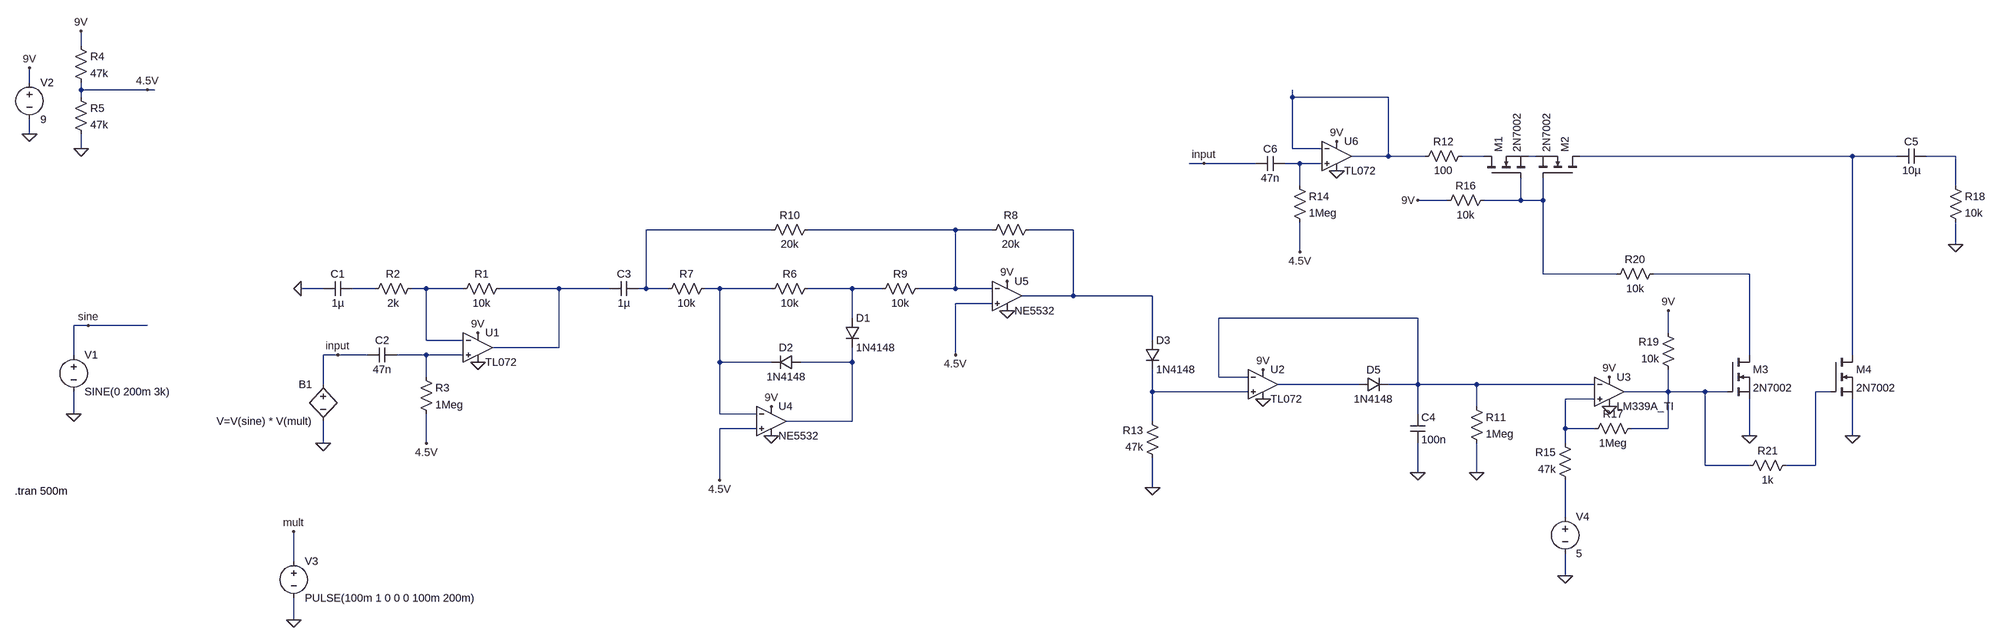
[diagram p0: schematic threshold.asc]
threshold.asc, the LTspice schematic file:
Version 4
SHEET 1 4932 804
WIRE -656 -464 -656 -496
WIRE -768 -384 -768 -416
WIRE -656 -368 -656 -384
WIRE -512 -368 -656 -368
WIRE -496 -368 -512 -368
WIRE -656 -352 -656 -368
WIRE 2256 -352 2256 -368
WIRE 2464 -352 2256 -352
WIRE -768 -272 -768 -304
WIRE -656 -240 -656 -272
WIRE 2256 -240 2256 -352
WIRE 2320 -240 2256 -240
WIRE 2464 -224 2464 -352
WIRE 2464 -224 2384 -224
WIRE 2544 -224 2464 -224
WIRE 2672 -224 2624 -224
WIRE 2784 -224 2768 -224
WIRE 3472 -224 2880 -224
WIRE 3568 -224 3472 -224
WIRE 3696 -224 3632 -224
WIRE 2064 -208 2032 -208
WIRE 2176 -208 2064 -208
WIRE 2272 -208 2240 -208
WIRE 2320 -208 2272 -208
WIRE 2272 -160 2272 -208
WIRE 3696 -160 3696 -224
WIRE 2592 -128 2528 -128
WIRE 2752 -128 2752 -176
WIRE 2752 -128 2672 -128
WIRE 2800 -128 2800 -176
WIRE 2800 -128 2752 -128
WIRE 976 -64 704 -64
WIRE 1376 -64 1056 -64
WIRE 1456 -64 1376 -64
WIRE 1632 -64 1536 -64
WIRE 3696 -32 3696 -80
WIRE 2272 -16 2272 -80
WIRE 2800 32 2800 -128
WIRE 2960 32 2800 32
WIRE 3248 32 3040 32
WIRE -112 64 -160 64
WIRE 0 64 -48 64
WIRE 112 64 80 64
WIRE 192 64 112 64
WIRE 400 64 272 64
WIRE 624 64 400 64
WIRE 704 64 704 -64
WIRE 704 64 688 64
WIRE 752 64 704 64
WIRE 864 64 832 64
WIRE 976 64 864 64
WIRE 1152 64 1056 64
WIRE 1216 64 1152 64
WIRE 1376 64 1376 -64
WIRE 1376 64 1296 64
WIRE 1456 64 1376 64
WIRE 1632 80 1632 -64
WIRE 1632 80 1520 80
WIRE 1952 80 1632 80
WIRE 1456 96 1376 96
WIRE 1152 128 1152 64
WIRE 2528 128 2096 128
WIRE -640 144 -672 144
WIRE -512 144 -640 144
WIRE 3072 160 3072 112
WIRE 112 176 112 64
WIRE 192 176 112 176
WIRE 1952 176 1952 80
WIRE 400 192 400 64
WIRE 400 192 256 192
WIRE -672 208 -672 144
WIRE -80 208 -112 208
WIRE -16 208 -80 208
WIRE 112 208 48 208
WIRE 192 208 112 208
WIRE 1376 208 1376 96
WIRE 3248 208 3248 32
WIRE 3472 208 3472 -224
WIRE 864 224 864 64
WIRE 976 224 864 224
WIRE 1152 224 1152 192
WIRE 1152 224 1040 224
WIRE 112 256 112 208
WIRE 2096 256 2096 128
WIRE 2160 256 2096 256
WIRE -112 272 -112 208
WIRE 2400 272 2224 272
WIRE 2528 272 2528 128
WIRE 2528 272 2464 272
WIRE 2656 272 2528 272
WIRE 2912 272 2656 272
WIRE 1952 288 1952 240
WIRE 2160 288 1952 288
WIRE 3072 288 3072 240
WIRE 3072 288 2976 288
WIRE 3152 288 3072 288
WIRE 3200 288 3152 288
WIRE 3424 288 3392 288
WIRE 2912 304 2848 304
WIRE 2656 320 2656 272
WIRE -672 336 -672 288
WIRE 864 336 864 224
WIRE 944 336 864 336
WIRE 2528 336 2528 272
WIRE 1152 352 1152 224
WIRE 1152 352 1008 352
WIRE 1952 352 1952 288
WIRE 944 368 864 368
WIRE 2848 368 2848 304
WIRE 2912 368 2848 368
WIRE 3072 368 3072 288
WIRE 3072 368 2992 368
WIRE 3248 384 3248 304
WIRE 3472 384 3472 304
WIRE -112 400 -112 352
WIRE 112 400 112 336
WIRE 2848 400 2848 368
WIRE 3152 448 3152 288
WIRE 3248 448 3152 448
WIRE 3392 448 3392 288
WIRE 3392 448 3328 448
WIRE 2528 464 2528 400
WIRE 2656 464 2656 400
WIRE 864 480 864 368
WIRE 1952 496 1952 432
WIRE 2848 560 2848 480
WIRE -176 656 -176 592
WIRE 2848 688 2848 640
WIRE -176 784 -176 736
FLAG 224 160 9V
FLAG 224 224 0
FLAG -160 64 0
FLAG -768 -416 9V
FLAG -768 -272 0
FLAG -656 -496 9V
FLAG -656 -240 0
FLAG -512 -368 4.5V
FLAG 112 400 4.5V
FLAG -672 336 0
FLAG 976 320 9V
FLAG 976 384 0
FLAG 864 480 4.5V
FLAG 1488 48 9V
FLAG 1488 112 0
FLAG 1376 208 4.5V
FLAG 2192 240 9V
FLAG 2192 304 0
FLAG 1952 496 0
FLAG 2528 464 0
FLAG 2656 464 0
FLAG -176 784 0
FLAG -176 592 mult
FLAG -112 400 0
FLAG -640 144 sine
FLAG -80 208 input
FLAG 2064 -208 input
FLAG 2352 -256 9V
FLAG 2352 -192 0
FLAG 2944 256 9V
FLAG 2944 320 0
FLAG 2848 688 0
FLAG 3696 -32 0
FLAG 2272 -16 4.5V
FLAG 2528 -128 9V
FLAG 3072 112 9V
FLAG 3248 384 0
FLAG 3472 384 0
SYMBOL ZZZ\\OpAmp\\TL072 224 192 R0
SYMATTR InstName U1
SYMBOL res 288 48 R90
WINDOW 0 0 56 VBottom 2
WINDOW 3 32 56 VTop 2
SYMATTR InstName R1
SYMATTR Value 10k
SYMBOL res 96 48 R90
WINDOW 0 0 56 VBottom 2
WINDOW 3 32 56 VTop 2
SYMATTR InstName R2
SYMATTR Value 2k
SYMBOL cap -48 48 R90
WINDOW 0 0 32 VBottom 2
WINDOW 3 32 32 VTop 2
SYMATTR InstName C1
SYMATTR Value 1µ
SYMBOL res 96 240 R0
SYMATTR InstName R3
SYMATTR Value 1Meg
SYMBOL cap 48 192 R90
WINDOW 0 0 32 VBottom 2
WINDOW 3 32 32 VTop 2
SYMATTR InstName C2
SYMATTR Value 47n
SYMBOL voltage -672 192 R0
WINDOW 123 0 0 Left 0
WINDOW 39 0 0 Left 0
SYMATTR InstName V1
SYMATTR Value SINE(0 200m 3k)
SYMBOL voltage -768 -400 R0
WINDOW 123 0 0 Left 0
WINDOW 39 0 0 Left 0
SYMATTR InstName V2
SYMATTR Value 9
SYMBOL res -672 -480 R0
SYMATTR InstName R4
SYMATTR Value 47k
SYMBOL res -672 -368 R0
SYMATTR InstName R5
SYMATTR Value 47k
SYMBOL res 1072 48 R90
WINDOW 0 0 56 VBottom 2
WINDOW 3 32 56 VTop 2
SYMATTR InstName R6
SYMATTR Value 10k
SYMBOL cap 688 48 R90
WINDOW 0 0 32 VBottom 2
WINDOW 3 32 32 VTop 2
SYMATTR InstName C3
SYMATTR Value 1µ
SYMBOL res 848 48 R90
WINDOW 0 0 56 VBottom 2
WINDOW 3 32 56 VTop 2
SYMATTR InstName R7
SYMATTR Value 10k
SYMBOL res 1312 48 R90
WINDOW 0 0 56 VBottom 2
WINDOW 3 32 56 VTop 2
SYMATTR InstName R9
SYMATTR Value 10k
SYMBOL res 1072 -80 R90
WINDOW 0 0 56 VBottom 2
WINDOW 3 32 56 VTop 2
SYMATTR InstName R10
SYMATTR Value 20k
SYMBOL diode 1136 128 R0
SYMATTR InstName D1
SYMATTR Value 1N4148
SYMBOL diode 1040 208 R90
WINDOW 0 0 32 VBottom 2
WINDOW 3 32 32 VTop 2
SYMATTR InstName D2
SYMATTR Value 1N4148
SYMBOL res 1552 -80 R90
WINDOW 0 0 56 VBottom 2
WINDOW 3 32 56 VTop 2
SYMATTR InstName R8
SYMATTR Value 20k
SYMBOL ZZZ\\OpAmp\\NE5532 976 352 R0
SYMATTR InstName U4
SYMBOL ZZZ\\OpAmp\\NE5532 1488 80 R0
SYMATTR InstName U5
SYMBOL diode 1936 176 R0
SYMATTR InstName D3
SYMATTR Value 1N4148
SYMBOL res 1968 448 R180
WINDOW 0 36 76 Left 2
WINDOW 3 36 40 Left 2
SYMATTR InstName R13
SYMATTR Value 47k
SYMBOL diode 2400 288 R270
WINDOW 0 32 32 VTop 2
WINDOW 3 0 32 VBottom 2
SYMATTR InstName D5
SYMATTR Value 1N4148
SYMBOL cap 2512 336 R0
SYMATTR InstName C4
SYMATTR Value 100n
SYMBOL ZZZ\\OpAmp\\TL072 2192 272 R0
SYMATTR InstName U2
SYMBOL res 2640 304 R0
SYMATTR InstName R11
SYMATTR Value 1Meg
SYMBOL voltage -176 640 R0
WINDOW 123 0 0 Left 0
WINDOW 39 0 0 Left 0
SYMATTR InstName V3
SYMATTR Value PULSE(100m 1 0 0 0 100m 200m)
SYMBOL bv -112 256 M0
SYMATTR InstName B1
SYMATTR Value V=V(sine) * V(mult)
SYMBOL ZZZ\\Comparator\\LM339A_TI 2944 288 R0
SYMATTR InstName U3
SYMBOL ZZZ\\OpAmp\\TL072 2352 -224 R0
SYMATTR InstName U6
SYMBOL res 2640 -240 R90
WINDOW 0 0 56 VBottom 2
WINDOW 3 32 56 VTop 2
SYMATTR InstName R12
SYMATTR Value 100
SYMBOL voltage 2848 544 R0
WINDOW 123 0 0 Left 0
WINDOW 39 0 0 Left 0
SYMATTR InstName V4
SYMATTR Value 5
SYMBOL res 2864 496 R180
WINDOW 0 36 76 Left 2
WINDOW 3 36 40 Left 2
SYMATTR InstName R15
SYMATTR Value 47k
SYMBOL res 3008 352 R90
WINDOW 0 0 56 VBottom 2
WINDOW 3 32 56 VTop 2
SYMATTR InstName R17
SYMATTR Value 1Meg
SYMBOL cap 3632 -240 R90
WINDOW 0 0 32 VBottom 2
WINDOW 3 32 32 VTop 2
SYMATTR InstName C5
SYMATTR Value 10µ
SYMBOL res 3680 -176 R0
SYMATTR InstName R18
SYMATTR Value 10k
SYMBOL res 2256 -176 R0
SYMATTR InstName R14
SYMATTR Value 1Meg
SYMBOL cap 2240 -224 R90
WINDOW 0 0 32 VBottom 2
WINDOW 3 32 32 VTop 2
SYMATTR InstName C6
SYMATTR Value 47n
SYMBOL nmos 2672 -176 R270
SYMATTR InstName M1
SYMATTR Value 2N7002
SYMBOL nmos 2880 -176 M270
SYMATTR InstName M2
SYMATTR Value 2N7002
SYMBOL res 2688 -144 R90
WINDOW 0 0 56 VBottom 2
WINDOW 3 32 56 VTop 2
SYMATTR InstName R16
SYMATTR Value 10k
SYMBOL nmos 3200 208 R0
SYMATTR InstName M3
SYMATTR Value 2N7002
SYMBOL res 3088 256 R180
WINDOW 0 36 76 Left 2
WINDOW 3 36 40 Left 2
SYMATTR InstName R19
SYMATTR Value 10k
SYMBOL res 3056 16 R90
WINDOW 0 0 56 VBottom 2
WINDOW 3 32 56 VTop 2
SYMATTR InstName R20
SYMATTR Value 10k
SYMBOL nmos 3424 208 R0
SYMATTR InstName M4
SYMATTR Value 2N7002
SYMBOL res 3344 432 R90
WINDOW 0 0 56 VBottom 2
WINDOW 3 32 56 VTop 2
SYMATTR InstName R21
SYMATTR Value 1k
TEXT -800 504 Left 2 !.tran 500m

The netlist it stands for:
* threshold.asc
* U1: TL072 (symbol ZZZ\OpAmp\TL072 not available, pins judged from their places): In+=N018 In-=N013 V+=9V V-=0 OUT=N014
R1 N014 N013 10k
R2 N013 N012 2k
C1 N012 0 1µ
R3 N018 4.5V 1Meg
C2 N018 input 47n
V1 sine 0 SINE(0 200m 3k)
V2 9V 0 9
R4 9V 4.5V 47k
R5 4.5V 0 47k
R6 N016 N015 10k
C3 N008 N014 1µ
R7 N015 N008 10k
R9 N009 N016 10k
R10 N009 N008 20k
D1 N016 N019 1N4148
D2 N019 N015 1N4148
R8 N010 N009 20k
XU4 4.5V N015 9V 0 N019 NE5532  ; pins In+ In- V+ V- OUT
XU5 4.5V N009 9V 0 N010 NE5532  ; pins In+ In- V+ V- OUT
D3 N010 N021 1N4148
R13 0 N021 47k
D5 N020 N017 1N4148
C4 N017 0 100n
* U2: TL072 (symbol ZZZ\OpAmp\TL072 not available, pins judged from their places): In+=N021 In-=N017 V+=9V V-=0 OUT=N020
R11 N017 0 1Meg
V3 mult 0 PULSE(100m 1 0 0 0 100m 200m)
B1 input 0 V=V(sine) * V(mult)
* U3: LM339A_TI (symbol ZZZ\Comparator\LM339A_TI not available, pins judged from their places): In+=N024 In-=N017 V+=9V V-=0 OUT=N022
* U6: TL072 (symbol ZZZ\OpAmp\TL072 not available, pins judged from their places): In+=N006 In-=N001 V+=9V V-=0 OUT=N001
R12 N002 N001 100
V4 N025 0 5
R15 N025 N024 47k
R17 N022 N024 1Meg
C5 N005 N004 10µ
R18 N005 0 10k
R14 N006 4.5V 1Meg
C6 N006 input 47n
M1 N002 N007 N003 N003 2N7002
M2 N004 N007 N003 N003 2N7002
R16 N007 9V 10k
M3 N011 N022 0 0 2N7002
R19 N022 9V 10k
R20 N011 N007 10k
M4 N004 N023 0 0 2N7002
R21 N023 N022 1k
.model D D
.lib standard.dio
.model NMOS NMOS
.model PMOS PMOS
.lib standard.mos
.tran 500m
.backanno
.end